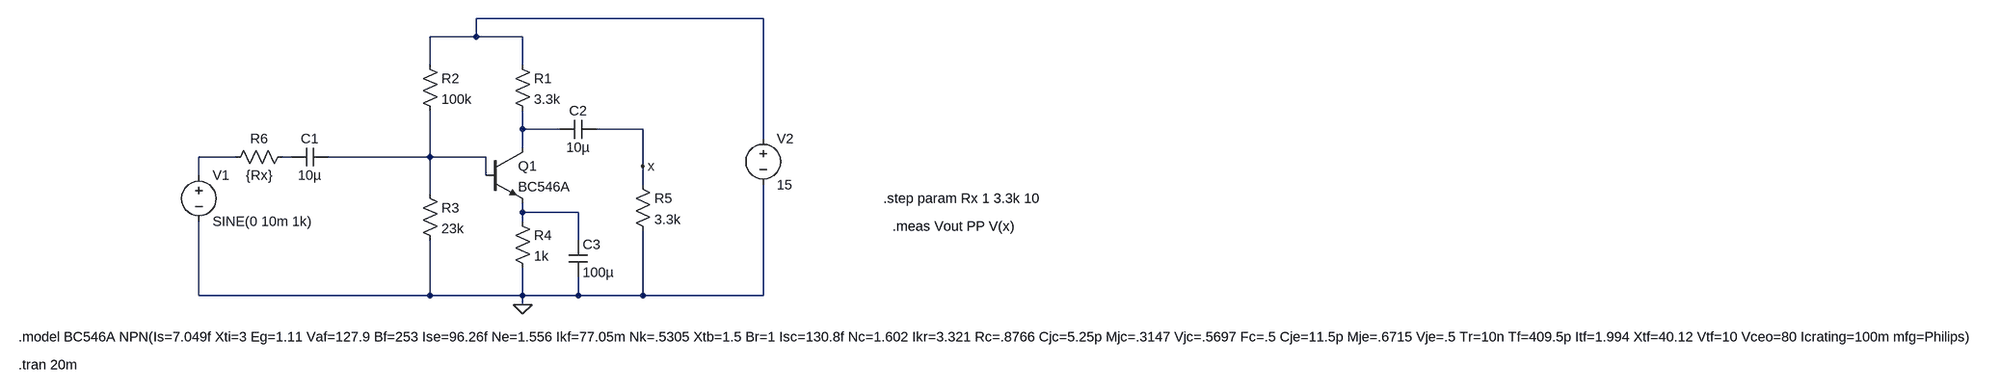
[diagram p0: schematic CommonEmitterCircuit.asc]
CommonEmitterCircuit.asc, the LTspice schematic file:
Version 4
SHEET 1 3636 680
WIRE 640 -144 144 -144
WIRE 144 -112 144 -144
WIRE 144 -112 64 -112
WIRE 224 -112 144 -112
WIRE 64 -64 64 -112
WIRE 224 -64 224 -112
WIRE 224 48 224 16
WIRE 288 48 224 48
WIRE 432 48 352 48
WIRE 640 64 640 -144
WIRE 224 80 224 48
WIRE -272 96 -336 96
WIRE -176 96 -192 96
WIRE 64 96 64 16
WIRE 64 96 -112 96
WIRE 160 96 64 96
WIRE 432 112 432 48
WIRE -336 128 -336 96
WIRE 160 128 160 96
WIRE 432 144 432 112
WIRE 64 160 64 96
WIRE 224 192 224 176
WIRE 320 192 224 192
WIRE 224 208 224 192
WIRE 320 240 320 192
WIRE -336 336 -336 208
WIRE 64 336 64 240
WIRE 64 336 -336 336
WIRE 224 336 224 288
WIRE 224 336 64 336
WIRE 320 336 320 304
WIRE 320 336 224 336
WIRE 432 336 432 224
WIRE 432 336 320 336
WIRE 640 336 640 144
WIRE 640 336 432 336
WIRE 224 352 224 336
FLAG 224 352 0
FLAG 432 112 x
SYMBOL npn 160 80 R0
SYMATTR InstName Q1
SYMATTR Value BC546A
SYMBOL res 208 -80 R0
SYMATTR InstName R1
SYMATTR Value 3.3k
SYMBOL res 48 -80 R0
SYMATTR InstName R2
SYMATTR Value 100k
SYMBOL res 48 144 R0
SYMATTR InstName R3
SYMATTR Value 23k
SYMBOL res 208 192 R0
SYMATTR InstName R4
SYMATTR Value 1k
SYMBOL res 416 128 R0
SYMATTR InstName R5
SYMATTR Value 3.3k
SYMBOL voltage -336 112 R0
WINDOW 123 0 0 Left 0
WINDOW 39 0 0 Left 0
SYMATTR InstName V1
SYMATTR Value SINE(0 10m 1k)
SYMBOL voltage 640 48 R0
WINDOW 123 0 0 Left 0
WINDOW 39 0 0 Left 0
SYMATTR InstName V2
SYMATTR Value 15
SYMBOL cap -112 80 R90
WINDOW 0 0 32 VBottom 2
WINDOW 3 32 32 VTop 2
SYMATTR InstName C1
SYMATTR Value 10µ
SYMBOL cap 352 32 R90
WINDOW 0 0 32 VBottom 2
WINDOW 3 32 32 VTop 2
SYMATTR InstName C2
SYMATTR Value 10µ
SYMBOL cap 304 240 R0
SYMATTR InstName C3
SYMATTR Value 100µ
SYMBOL res -176 80 R90
WINDOW 0 0 56 VBottom 2
WINDOW 3 32 56 VTop 2
SYMATTR InstName R6
SYMATTR Value {Rx}
TEXT -648 408 Left 2 !.model BC546A NPN(Is=7.049f Xti=3 Eg=1.11 Vaf=127.9 Bf=253 Ise=96.26f Ne=1.556 Ikf=77.05m Nk=.5305 Xtb=1.5 Br=1 Isc=130.8f Nc=1.602 Ikr=3.321 Rc=.8766 Cjc=5.25p Mjc=.3147 Vjc=.5697 Fc=.5 Cje=11.5p Mje=.6715 Vje=.5 Tr=10n Tf=409.5p Itf=1.994 Xtf=40.12 Vtf=10 Vceo=80 Icrating=100m mfg=Philips)
TEXT 848 168 Left 2 !.step param Rx 1 3.3k 10
TEXT -648 456 Left 2 !.tran 20m
TEXT 864 216 Left 2 !.meas Vout PP V(x)

The netlist it stands for:
* CommonEmitterCircuit.asc
Q1 N002 N005 N006 0 BC546A
R1 N001 N002 3.3k
R2 N001 N005 100k
R3 N005 0 23k
R4 N006 0 1k
R5 x 0 3.3k
V1 N003 0 SINE(0 10m 1k)
V2 N001 0 15
C1 N005 N004 10µ
C2 x N002 10µ
C3 N006 0 100µ
R6 N004 N003 {Rx}
.model NPN NPN
.model PNP PNP
.lib standard.bjt
.model BC546A NPN(Is=7.049f Xti=3 Eg=1.11 Vaf=127.9 Bf=253 Ise=96.26f Ne=1.556 Ikf=77.05m Nk=.5305 Xtb=1.5 Br=1 Isc=130.8f Nc=1.602 Ikr=3.321 Rc=.8766 Cjc=5.25p Mjc=.3147 Vjc=.5697 Fc=.5 Cje=11.5p Mje=.6715 Vje=.5 Tr=10n Tf=409.5p Itf=1.994 Xtf=40.12 Vtf=10 Vceo=80 Icrating=100m mfg=Philips)
.step param Rx 1 3.3k 10
.tran 20m
.meas Vout PP V(x)
.backanno
.end